# Altium project AkhromCNY V2.PrjPcb
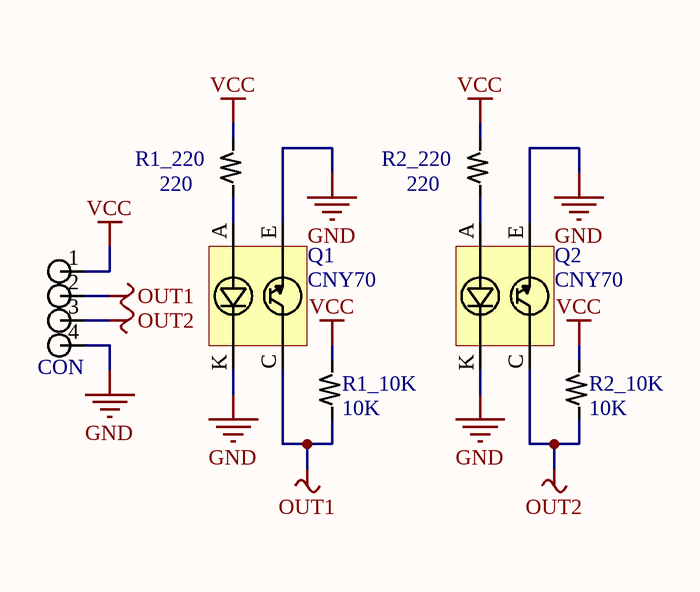
[diagram p0: CNYBoard.SchDoc]
1 sheet, 7 parts. Net scope: global (net labels, ports and power ports of the same name join across sheets).
Board file: CNYBoard.PcbDoc

## Sheet CNYBoard.SchDoc
size A4

### Parts
CON  HEADER-4  [HEADER-4-VERTICAL]  (value not drawn)
Q1  CNY70  [CNY70_LIB]
Q2  CNY70  [CNY70_LIB]
R1_10K  value 10K  [RES-Axial-400mil]  (hidden comment: RES)
R1_220  value 220  [RES-Axial-400mil]  (hidden comment: RES)
R2_10K  value 10K  [RES-Axial-400mil]  (hidden comment: RES)
R2_220  value 220  [RES-Axial-400mil]  (hidden comment: RES)

### Nets
GND: CON.4 Q1.E Q1.K Q2.E Q2.K
OUT1: CON.2 Q1.C R1_10K.2
OUT2: CON.3 Q2.C R2_10K.2
VCC: CON.1 R1_10K.1 R1_220.1 R2_10K.1 R2_220.1
NetQ1_A: Q1.A R1_220.2
NetQ2_A: Q2.A R2_220.2